# Altium schematic sheet usb_host_slave.SchDoc: Edison Breakout
size Letter; Author: Ye-Sheng Kuo; Revision: 1; SheetTotal: 9
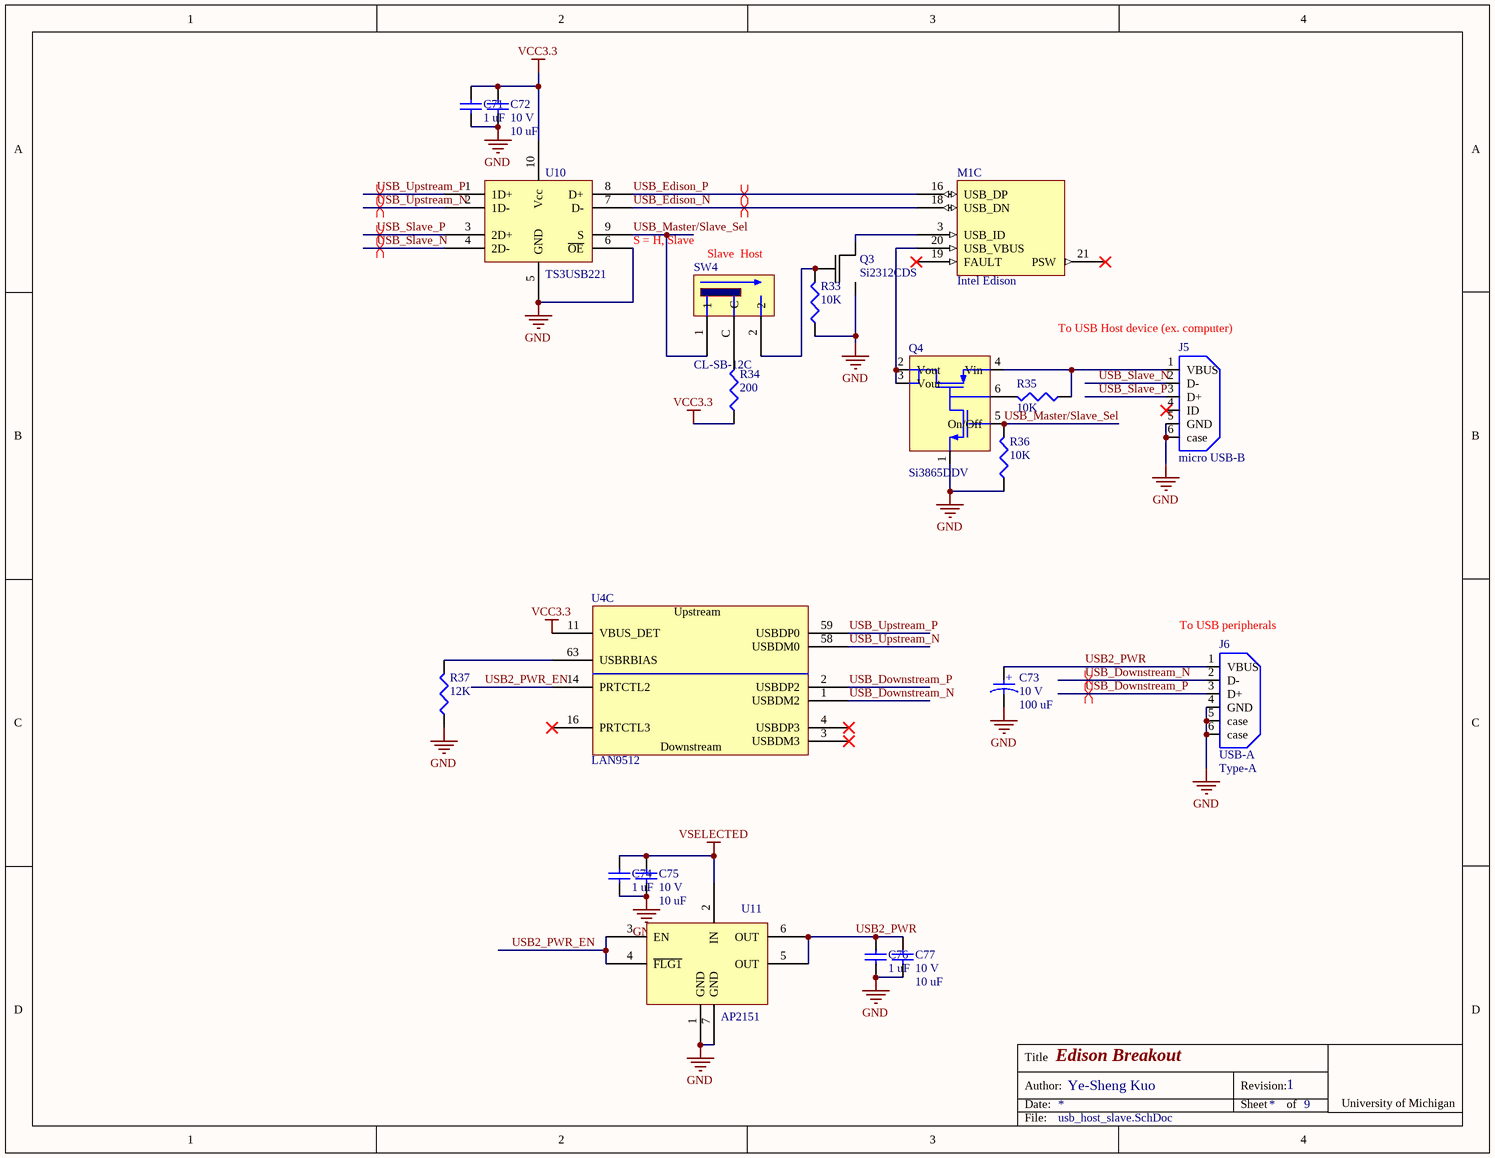
[diagram p0: usb_host_slave.SchDoc]

## Parts
C71  value 1 uF  [0402]  (hidden comment: Ceramic capacitor)
C72  value 10 uF  voltage rated: 10 V  [0603]  (hidden comment: Ceramic capacitor)
C73  value 100 uF  voltage rated: 10 V  [1206 - POLAR MARKING]  (hidden comment: Tantalum capacitor)
C74  value 1 uF  [0402]  (hidden comment: Ceramic capacitor)
C75  value 10 uF  voltage rated: 10 V  [0603]  (hidden comment: Ceramic capacitor)
C76  value 1 uF  [0402]  (hidden comment: Ceramic capacitor)
C77  value 10 uF  voltage rated: 10 V  [0603]  (hidden comment: Ceramic capacitor)
J5  micro USB-B  [Micro USB-B]
J6  USB-A  Type: Type-A  [292303-2]
M1  Intel Edison  [Intel Edison mating]  (part C of 5)
Q3  Si2312CDS  [SOT23-3]
Q4  Si3865DDV  [TSOT-23]
R33  value 10K  [0402]  (hidden comment: Chip resistor)
R34  value 200  [0402]  (hidden comment: Chip resistor)
R35  value 10K  [0402]  (hidden comment: Chip resistor)
R36  value 10K  [0402]  (hidden comment: Chip resistor)
R37  value 12K  [0402]  (hidden comment: Chip resistor)
SW4  CL-SB-12C  [CL-SB-12C]
U4  LAN9512  [QFN-64]  (part C of 5)
U10  TS3USB221  [PUQFN-10]
U11  AP2151  [U-DFN2018-6]

## Nets
GND: C71.2 C72.2 C73.2 C74.2 C75.2 C76.2 C77.2 J5.5(GND) J5.6(case) J6.4(GND) J6.5(case) J6.6(case) Q3.2(S) Q4.1 R33.2 R36.2 R37.2 U10.5(GND) U10.6(~{OE}) U11.1(GND) U11.7(GND)
VCC3.3: C71.1 C72.1 R34.2 U4.11(VBUS_DET) U10.10(Vcc)
VSELECTED: C74.1 C75.1 U11.2(IN)
USB2_PWR: C73.1 C76.1 C77.1 J6.1(VBUS) U11.5(OUT) U11.6(OUT)
USB2_PWR_EN: U4.14(PRTCTL2) U11.3(EN) U11.4(~{FLG1})
USB_Downstream_N: J6.2(D-) U4.1(USBDM2)
USB_Downstream_P: J6.3(D+) U4.2(USBDP2)
USB_Edison_N: M1.18(USB_DN) U10.7(D-)
USB_Edison_P: M1.16(USB_DP) U10.8(D+)
USB_Master/Slave_Sel: Q4.5(On/Off) R36.1 SW4.1 U10.9(S)
USB_Slave_N: J5.2(D-) U10.4(2D-)
USB_Slave_P: J5.3(D+) U10.3(2D+)
USB_Upstream_N: U4.58(USBDM0) U10.2(1D-)
USB_Upstream_P: U4.59(USBDP0) U10.1(1D+)
NetJ5_1: J5.1(VBUS) Q4.4(Vin) R35.2
NetM1_3: M1.3(USB_ID) Q3.3(D)
NetM1_20: M1.20(USB_VBUS) Q4.2(Vout) Q4.3(Vout)
NetQ3_1: Q3.1(G) R33.1 SW4.2
NetQ4_6: Q4.6 R35.1
NetR34_1: R34.1 SW4.C
NetR37_1: R37.1 U4.63(USBRBIAS)

Not connected (* = marked no-connect by the designer): J5 4(ID)*; M1 19(FAULT)* 21(PSW)*; U4 3(USBDM3)* 4(USBDP3)* 16(PRTCTL3)*

## Layout directives
differential pair: USB_Downstream_N, USB_Downstream_P, USB_Edison_N, USB_Edison_P, USB_Slave_N, USB_Slave_P, USB_Upstream_N, USB_Upstream_P

## Notes on the sheet
- (near U10) S = H, Slave
- Slave  Host
- (near J5) To USB Host device (ex. computer)
- (near J6) To USB peripherals
- Title
- Date:
- Author:
- Revision:
- Sheet
- of
- University of Michigan
- File:
- (in symbol C_100u_10V_1206_tantalum) +
- (in symbol LAN9512, part C) Upstream; Downstream

## Library data of the parts
C71 C74 C76 = C_1u_16V_0402_ceramic: Ceramic capacitor, 1 uF, 16V, 0402 package; Manufacture: TDK; tolerance: 10%; Temperature rating: X5R; voltage rated: 16 V; package: 0402; Supplier 1: Digi-Key; Supplier Part Number 1: 445-4978-1-ND
C72 C75 C77 = C_10u_10V_0603_ceramic: Ceramic capacitor, 10 uF, 10 V, 0603 package; Manufacture: Murata; tolerance: 20%; Temperature Coefficient: X5R; package: 0603; Supplier 1: Digi-Key; Supplier Part Number 1: 490-7197-1-ND
C73 = C_100u_10V_1206_tantalum: Tantalum capacitor, 100 uF, 10 V, 1206 package; Manufacture: AVX; tolerance: 20%; package: 1206; Supplier 1: Digi-Key; Supplier Part Number 1: 478-6251-1-ND
J5 = Micro USB: CONN USB MICRO B RECPT SMT R/A; Supplier 1: Digi-Key; Supplier Part Number 1: 609-4616-1-ND
J6 = A105221-ND: USB 2.0 Type A; Supplier 1: Digi-Key; Supplier Part Number 1: A105221-ND
Q3 = Si2312CDS: N-Channel 20 V (D-S) MOSFET; Supplier 1: Digi-Key; Supplier Part Number 1: SI2312CDS-T1-GE3CT-ND
Q4 = Si3865DDV: Load Switch; Supplier 1: Digi-Key; Supplier Part Number 1: SI3865DDV-T1-GE3CT-ND
R33 R35 R36 = R_10K_0402: Chip resistor, 10K, 0402 package; tolerance: 1%; power: 1/16 W; package: 0402; Supplier 1: Digi-Key; Supplier Part Number 1: 541-10.0KLCT-ND
R34 = R_200_0402: Chip resistor, 200, 0402 package; tolerance: 1%; power: 1/16 W; package: 0402; Supplier 1: Digi-Key; Supplier Part Number 1: 541-200LCT-ND
R37 = R_12K_0402: Chip resistor, 12K, 0402 package; tolerance: 1%; power: 1/16 W; package: 0402; Supplier 1: Digi-Key; Supplier Part Number 1: 541-12.0KLCT-ND
SW4 = CL-SB-12C: SPST Slide switch; Supplier 1: Digi-Key; Supplier Part Number 1: 563-1322-ND
U4 = LAN9512: USB 2.0 Hub and 10/100  Ethernet Controller; Supplier 1: Digi-Key; Supplier Part Number 1: 638-1086-ND
U10 = TS3USB221: High-Speed USB 2.0 (480-Mbps) 1:2 Multiplexer – Demultiplexer  Switch With Single Enable; Supplier 1: Digi-Key; Supplier Part Number 1: 296-24019-1-ND
U11 = AP2151: 0.5A SINGLE CHANNEL CURRENT-LIMITED  POWER SWITCH WITH OUTPUT DISCHARGE; Supplier 1: Digi-Key; Supplier Part Number 1: AP2151FMG-7DICT-ND